# EasyEDA schematic SCH_pap01_2022-05-10.json
TITLE: ESP8266 Setup; REV: 1.0; Date: 2022-04-28; Sheet: 1/1; Drawn By: Lilia Lobato; Company: P2022_PAP4D08A
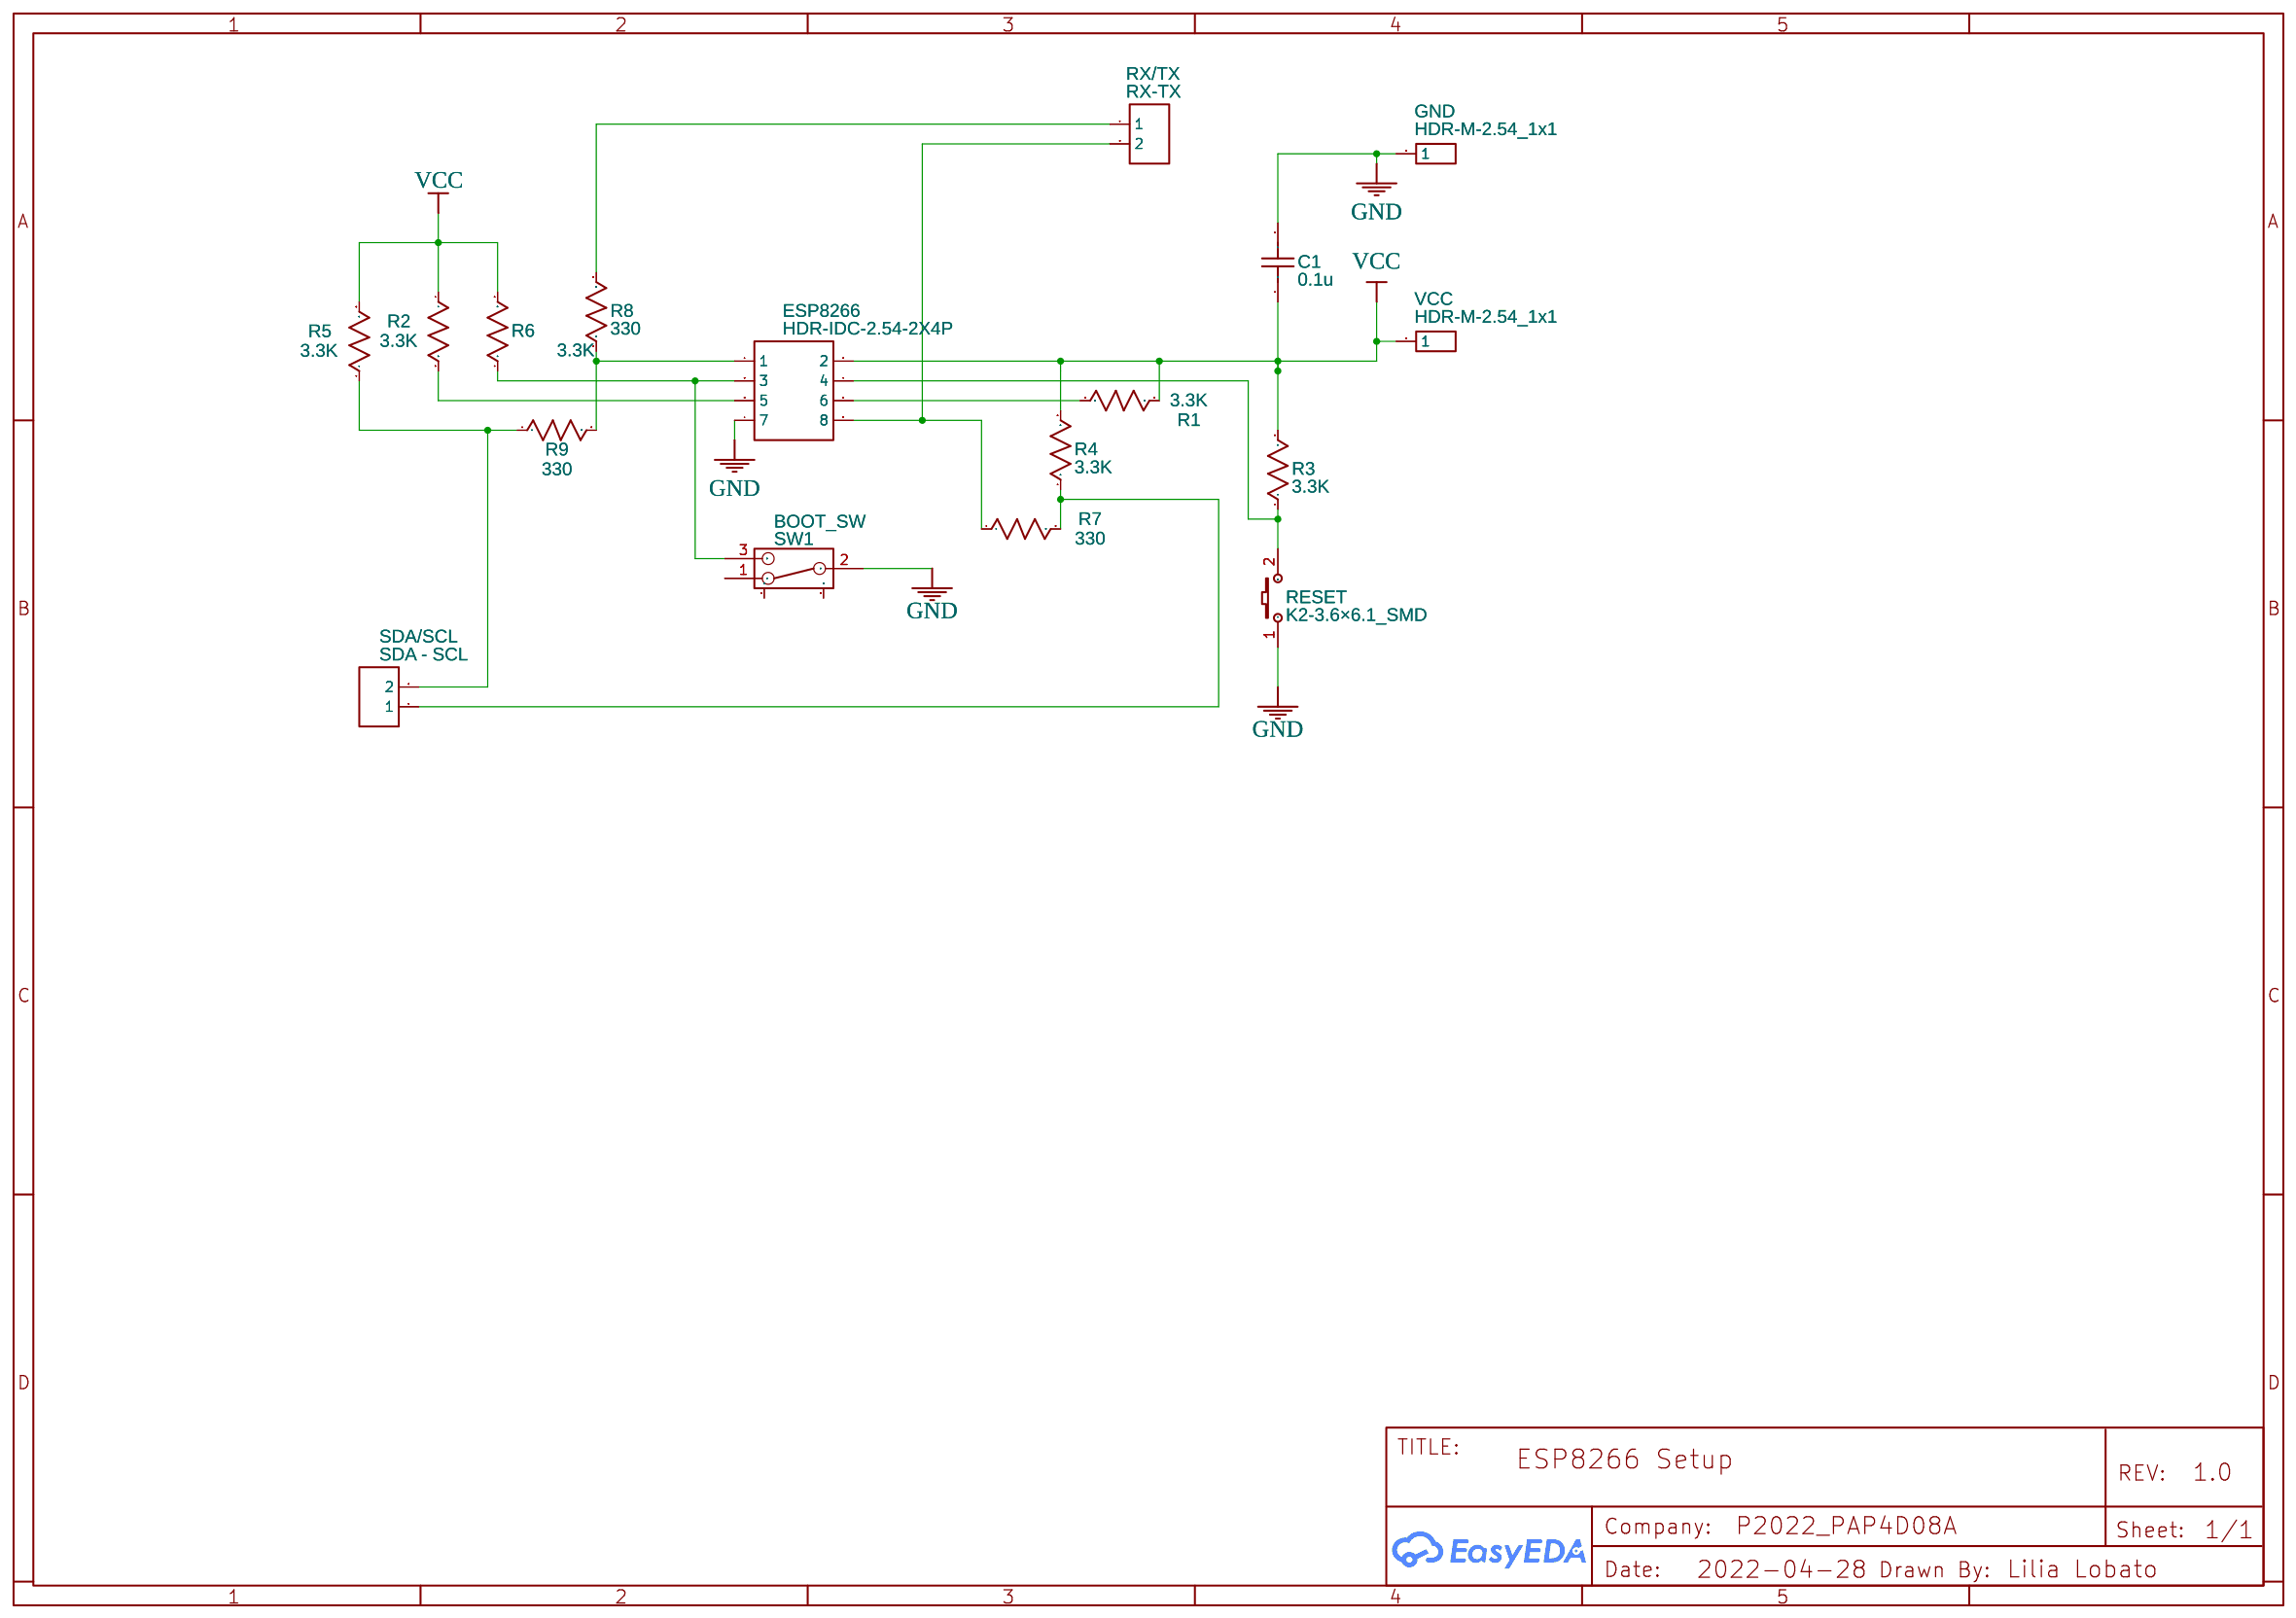
[diagram p0: schematic sheet]

## Parts
C1  0.1u  [C0603]
ESP8266  HDR-IDC-2.54-2X4P  [IDC-TH_8P-P2.54-V-R2-C4-S2.54]
GND  HDR-M-2.54_1x1  [HDR-M-2.54_1X1]
R1  3.3K  [R0603]
R2  3.3K  [R0603]
R3  3.3K  [R0603]
R4  3.3K  [R0603]
R5  3.3K  [R0603]
R6  3.3K  [R0603]
R7  330  [R0603]
R8  330  [R0603]
R9  330  [R0603]
RESET  K2-3.6×6.1_SMD  [KEY-SMD_2P-L6.2-W3.6-LS8.0]
RX/TX  RX-TX  [HDR-F-2.54_1X2]
SDA/SCL  SDA - SCL  [HDR-F-2.54_1X2]
SW1  BOOT_SW  [SW-TH_SS-12D02-VG4]
VCC  HDR-M-2.54_1x1  [HDR-M-2.54_1X1]

## Library data of the parts
C1 = C_0603_US: Contributor: LCEDA_Lib
ESP8266 = HDR-IDC-2.54-2X4P: Supplier: LCSC; Manufacturer: BOOMELE; Manufacturer Part: IDC Box 2X4 2.54MM; image: //image.lceda.cn/szlcsc/C9135.jpg; Supplier Part: C9135
GND VCC = HDR-M-2.54_1x1: Supplier Part: C81276; Supplier: LCSC; Contributor: LCEDA_Lib
R1-R9 = R_0603_US: Contributor: LCEDA_Lib
RESET = K2-3.6×6.1_SMD: Supplier Part: C118141; Supplier: LCSC; Manufacturer Part: K2-1107ST-A4SW-06; Contributor: LCEDA_Lib; 制造商: 韩国韩荣
RX/TX SDA/SCL = HDR-F-2.54_1x2: Supplier Part: C49661; Supplier: LCSC; Contributor: LCEDA_Lib
SW1 = SS-12D02-VG4: Supplier: LCSC; Supplier Part: C136719; Manufacturer: Rectangular Connectors - Contacts; Contributor: LCSC

## Nets
GND: C1.2 ESP8266.7 GND.1 RESET.1 SW1.2
VCC: C1.1 ESP8266.2 R1.1 R2.1 R3.2 R4.2 R5.2 R6.2 VCC.1
Net-(ESP8266-1): ESP8266.1 R8.1 R9.2
Net-(ESP8266-3): ESP8266.3 R6.1 SW1.3
Net-(ESP8266-4): ESP8266.4 R3.1 RESET.2
Net-(ESP8266-5): ESP8266.5 R2.2
Net-(ESP8266-6): ESP8266.6 R1.2
Net-(ESP8266-8): ESP8266.8 R7.1 RX/TX.2
Net-(R4-1): R4.1 R7.2 SDA/SCL.1
Net-(R5-1): R5.1 R9.1 SDA/SCL.2
Net-(R8-2): R8.2 RX/TX.1

Not connected (* = marked no-connect by the designer): SW1 1 4 5
